# EAGLE design SRAM Breakout (EAGLE 8.0.0)
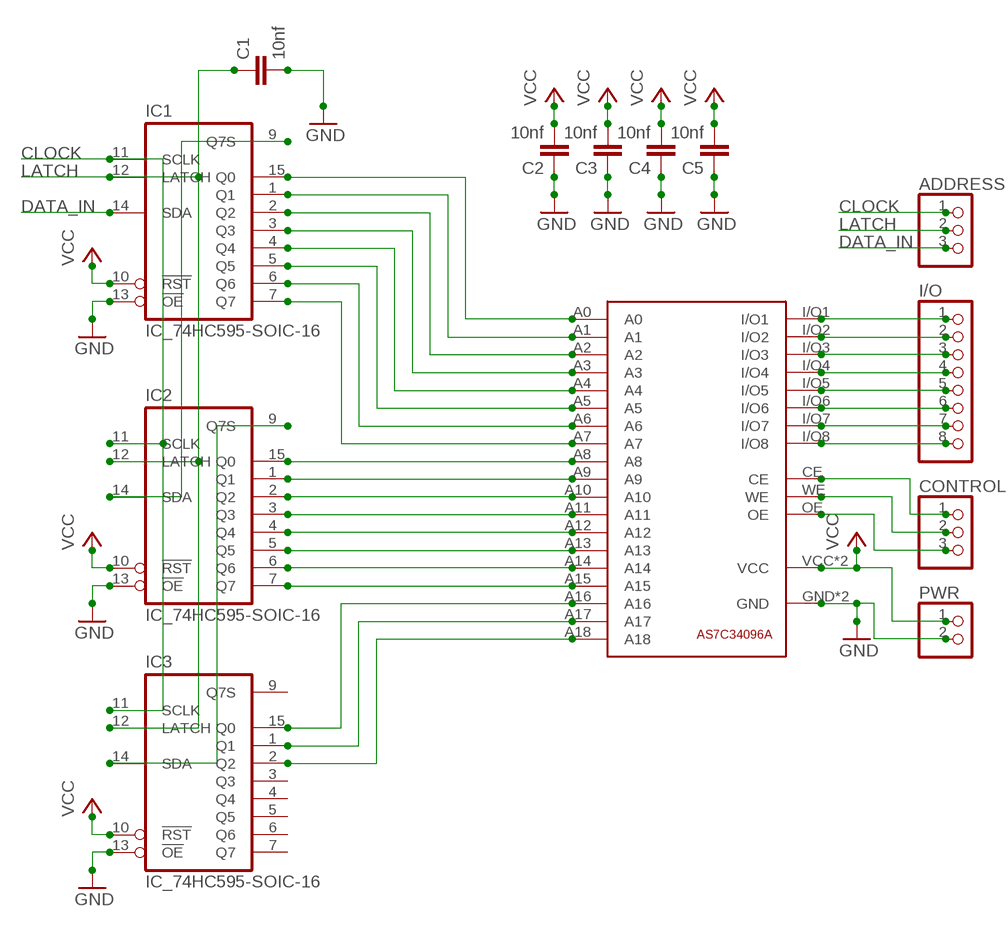
[diagram p0: schematic, sheet 1]

## Parts
ADDRESS  PINHD-1X3/90  [1X03/90]
C1  10nf  C-EUC0603  [C0603]
C2  10nf  C-EUC0603  [C0603]
C3  10nf  C-EUC0603  [C0603]
C4  10nf  C-EUC0603  [C0603]
C5  10nf  C-EUC0603  [C0603]
CONTROL  PINHD-1X3/90  [1X03/90]
I/O  PINHD-1X8/90  [1X08/90]
IC1  IC_74HC595-SOIC-16  [SOIC-16]
IC2  IC_74HC595-SOIC-16  [SOIC-16]
IC3  IC_74HC595-SOIC-16  [SOIC-16]
PWR  PINHD-1X2/90  [1X02/90]
U$1  AS7C34096A  [AS7C34096A]

## Nets
CLOCK: ADDRESS.1 IC1.11(SCLK) IC2.11(SCLK) IC3.11(SCLK)
DATA_IN: ADDRESS.3 IC1.14(SDA)
GND: C1.2 C2.1 C3.1 C4.1 C5.1 IC1.13(!OE) IC2.13(!OE) IC3.13(!OE) PWR.2 U$1.GND U$1.GND0(GND)
LATCH: ADDRESS.2 C1.1 IC1.12(LATCH) IC2.12(LATCH) IC3.12(LATCH)
N$1: IC1.9(Q7S) IC2.14(SDA)
N$2: IC2.9(Q7S) IC3.14(SDA)
N$3: I/O.1 U$1.I/O1
N$4: IC1.15(Q0) U$1.A0
N$5: IC1.1(Q1) U$1.A1
N$6: IC1.2(Q2) U$1.A2
N$7: IC1.3(Q3) U$1.A3
N$8: IC1.4(Q4) U$1.A4
N$9: IC1.5(Q5) U$1.A5
N$10: IC1.6(Q6) U$1.A6
N$11: IC1.7(Q7) U$1.A7
N$12: IC2.15(Q0) U$1.A8
N$13: IC2.1(Q1) U$1.A9
N$14: IC2.2(Q2) U$1.A10
N$15: IC2.3(Q3) U$1.A11
N$16: IC2.4(Q4) U$1.A12
N$17: IC2.5(Q5) U$1.A13
N$18: IC2.6(Q6) U$1.A14
N$19: IC2.7(Q7) U$1.A15
N$20: IC3.15(Q0) U$1.A16
N$21: IC3.1(Q1) U$1.A17
N$22: IC3.2(Q2) U$1.A18
N$23: I/O.2 U$1.I/O2
N$24: I/O.3 U$1.I/O3
N$25: I/O.4 U$1.I/O4
N$26: I/O.5 U$1.I/O5
N$27: I/O.6 U$1.I/O6
N$28: I/O.7 U$1.I/O7
N$29: I/O.8 U$1.I/O8
N$30: CONTROL.1 U$1.CE
N$31: CONTROL.2 U$1.WE
N$32: CONTROL.3 U$1.OE
VCC: C2.2 C3.2 C4.2 C5.2 IC1.10(!RST) IC2.10(!RST) IC3.10(!RST) PWR.1 U$1.VCC U$1.VCC0(VCC)
Unconnected: IC1.8(GND) IC1.16(V+) IC2.8(GND) IC2.16(V+) IC3.3(Q3) IC3.4(Q4) IC3.5(Q5) IC3.6(Q6) IC3.7(Q7) IC3.8(GND) IC3.9(Q7S) IC3.16(V+)

## Library data of the parts
ADDRESS CONTROL = pinhead:PINHD-1X3: PIN HEADER
C1-C5 = rcl:C-EU: CAPACITOR, European symbol
I/O = pinhead:PINHD-1X8: PIN HEADER
IC1-IC3 = dp_devices.v6:IC_74HC595: 8-bit serial-in parallel out shift register, output latch 3-state
PWR = pinhead:PINHD-1X2: PIN HEADER
U$1 = AS7C34096A:AS7C34096A

## Board
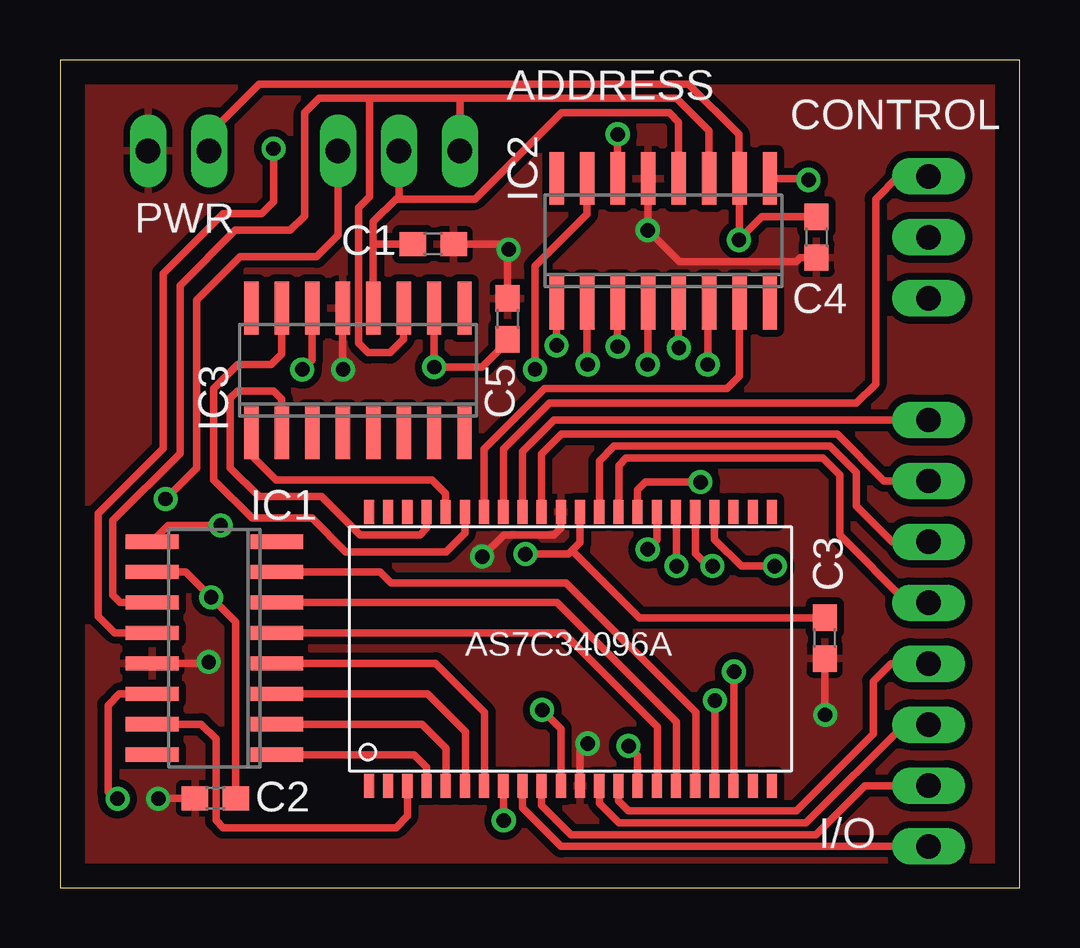
[diagram p1: board, top side]
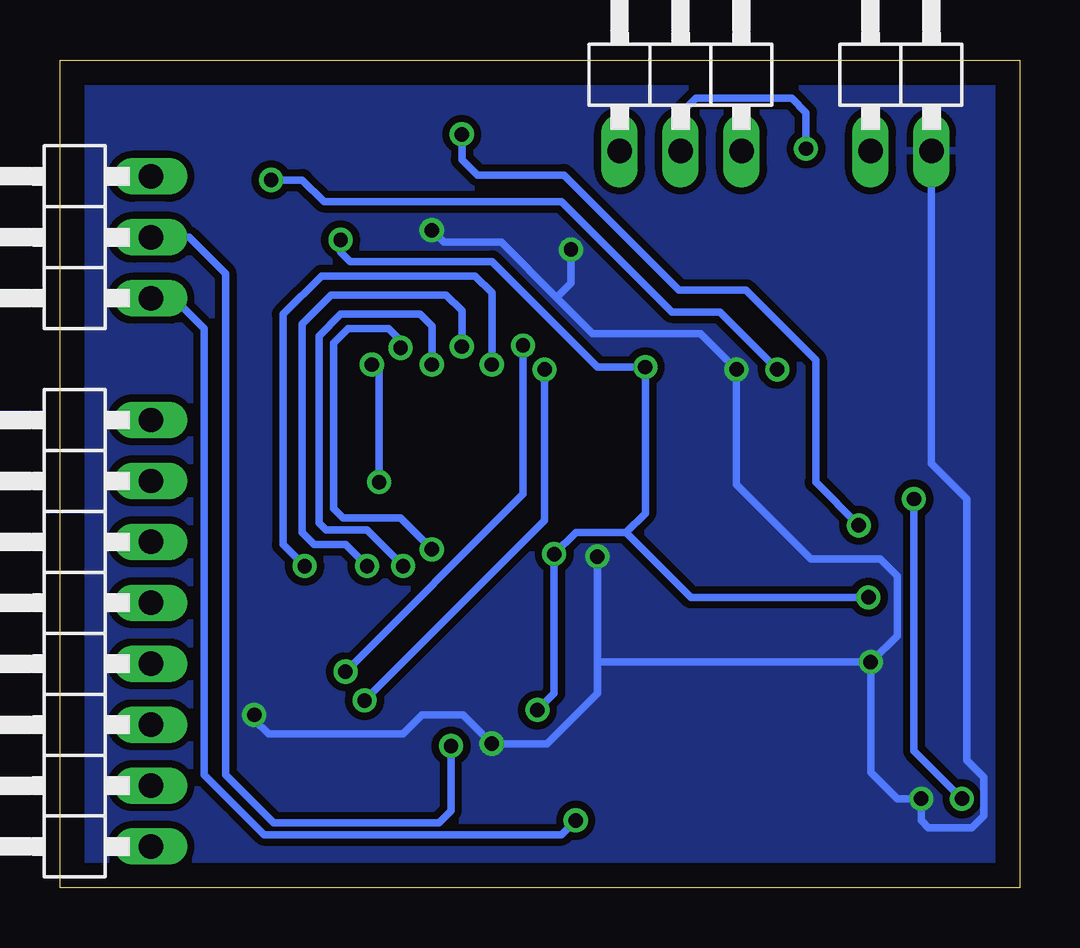
[diagram p2: board, bottom side, seen from below]

Size 40 x 34.5 mm. Coordinates in mm from the lower left corner, seen from the top.
Outline: 0,0 40,0 40,34.5 0,34.5 0,0
Copper layers (1*16): Top 0.035mm / dielectric 1.5mm / Bottom 0.035mm
Design rules "default": minimum track width 10mil, minimum drill 24mil, track to track 8mil, track to pad 8mil, pad to pad 8mil, via to via 8mil, smd to smd 8mil, copper to edge 40mil, drill to drill 8mil, minimum pad ring 10mil, minimum via ring 8mil, stop-mask expansion 4mil, vias tented up to drill 0mil, thermal gap 10mil

### Footprints (pad centres in the part's own frame; a part is rotated, then mirrored left to right if it is on the bottom)
1X03/90 = drill 1.016 long: 1 -2.54,-3.81; 2 0,-3.81; 3 2.54,-3.81
C0603 = smd 1.1 x 1: 1 -0.85,0; 2 0.85,0
1X08/90 = drill 1.016 long: 1 -8.89,-3.81; 2 -6.35,-3.81; 3 -3.81,-3.81; 4 -1.27,-3.81; 5 1.27,-3.81; 6 3.81,-3.81; 7 6.35,-3.81; 8 8.89,-3.81
SOIC-16 = smd 0.6 x 2.2: 1 -4.445,-2.6; 2 -3.175,-2.6; 3 -1.905,-2.6; 4 -0.635,-2.6; 5 0.635,-2.6; 6 1.905,-2.6; 7 3.175,-2.6; 8 4.445,-2.6; 9 4.445,2.6; 10 3.175,2.6; 11 1.905,2.6; 12 0.635,2.6; 13 -0.635,2.6; 14 -1.905,2.6; 15 -3.175,2.6; 16 -4.445,2.6
1X02/90 = drill 1.016 long: 1 -1.27,-3.81; 2 1.27,-3.81
AS7C34096A = smd 0.42 x 1: A0 2.4,0; A1 3.2,0; A2 4,0; A3 4.8,0; A4 5.6,0; A5 12.8,0; A6 13.6,0; A7 14.4,0; A8 15.2,0; A9 16,0; A10 15.2,11.4; A11 14.4,11.4; A12 13.6,11.4; A13 12.8,11.4; A14 12,11.4; A15 5.6,11.4; A16 4.8,11.4; A17 4,11.4; A18 3.2,11.4; CE 6.4,0; GND 9.6,0; GND0 8.8,11.4; I/O1 7.2,0; I/O2 8,0; I/O3 10.4,0; I/O4 11.2,0; I/O5 11.2,11.4; I/O6 10.4,11.4; I/O7 8,11.4; I/O8 7.2,11.4; NC 0.8,0; NC0 1.6,0; NC1 16.8,0; NC2 17.6,0; NC3 0.8,11.4; NC4 1.6,11.4; NC5 2.4,11.4; NC6 16,11.4; NC7 16.8,11.4; NC8 17.6,11.4; OE 6.4,11.4; VCC 8.8,0; VCC0 9.6,11.4; WE 12,0

### Placement (x,y rotation side)
ADDRESS  14.13,34.52 0 bottom
C1  15.56,26.82 0 top
C2  6.48,3.72 0 top
C3  31.88,10.4 90 top
C4  31.54,27.11 90 top
C5  18.66,23.71 270 top
CONTROL  40.02,27.11 90 bottom
I/O  40.02,10.6 90 bottom
IC1  6.44,9.98 90 top
IC2  25.15,26.96 0 top
IC3  12.42,21.56 0 top
PWR  4.94,34.52 0 bottom
U$1  12.08,4.25 0 top

### Tracks (layer width: path | path; a pad name or v marks a point on that pad's centre or on a via)
CLOCK
  Top 0.305: 12.9,32.9 12.9,28.8 12.45,28.35 12.45,22.7 12.85,22.3 13.75,22.3 14.32,22.88 IC3.11 | 16.6,32.9 25.7,32.9 27.05,31.55 IC2.11 | 16.6,32.9 12.9,32.9 | ADDRESS.1 16.67,32.83 16.6,32.9 | IC1.11 2.52,11.88 2.2,12.2 2.2,15.3 5,18.1 5,25.1 7.3,27.4 9.6,27.4 10.2,28 10.2,32.3 10.8,32.9 12.9,32.9
DATA_IN  (via drill 0.6)
  Top 0.305: ADDRESS.3 11.59,27.19 10.7,26.3 7.5,26.3 5.7,24.5 5.7,17.5 v4.4,16.2 | v2.4,3.7 2.3,3.7 2,4 2,7.6 2.48,8.07 IC1.14
  Bottom 0.305: v4.4,16.2 4.4,5.7 v2.4,3.7
GND  (via drill 0.6)
  Top 0.305: U$1.GND0 20.88,14.98 20.6,14.7 18.5,14.7 v17.6,13.8 | U$1.GND 21.68,5.68 v22,6 | IC1.13 6.14,9.35 v6.2,9.4 | IC3.13 11.79,21.61 v11.8,21.6 | 24.52,27.41 IC2.13 | 24.52,27.41 v24.5,27.4 | C3.1 31.88,7.22 v31.9,7.2 | C2.1 4.12,3.72 v4.1,3.7 | C4.1 30.86,26.26 30.7,26.1 25.83,26.1 24.52,27.41 | 18.66,26.56 C5.1 | 18.66,26.56 v18.7,26.6 | C1.2 18.4,26.82 18.66,26.56
  Bottom 0.305: 17.6,9.3 v17.6,13.8 | 17.6,9.3 17.6,8.1 19.7,6 v22,6 23.2,7.2 24.9,7.2 25.7,6.4 31.3,6.4 31.9,7 v31.9,7.2 | v6.2,9.4 17.5,9.4 17.6,9.3 | v6.2,9.4 5.1,10.5 5.1,13 5.8,13.7 8.7,13.7 11.8,16.8 v11.8,21.6 13.3,23.1 17.8,23.1 19.3,24.6 | v24.5,27.4 24,26.9 21.6,26.9 19.3,24.6 | v6.2,9.4 6.2,4.8 5.1,3.7 v4.1,3.7 4.1,2.8 3.8,2.5 2,2.5 1.5,3 1.5,4.6 2.2,5.3 2.2,16.2 3.67,17.67 PWR.2 | v18.7,26.6 18.7,25.2 19.3,24.6
  pour Bottom (isolate 0.305): 0,34.5 40,34.5 40,0 0.42,0 arc-90 0,0.32
  pour Top (isolate 0.305): 0,34.5 40,34.5 40,0 0,0
LATCH  (via drill 0.6)
  Top 0.305: IC2.12 25.79,31.91 25.4,32.3 20.9,32.3 17.3,28.7 14.2,28.7 | 14.2,28.7 14,28.7 13.05,27.75 13.05,26.9 | 13.05,26.9 IC3.12 | ADDRESS.2 14.13,28.77 14.2,28.7 | C1.1 13.13,26.82 13.05,26.9 | IC1.12 2.29,10.62 1.6,11.3 1.6,15.6 4.3,18.3 4.3,25.6 6.8,28.1 8.4,28.1 8.9,28.6 v8.9,30.8
  Bottom 0.305: v8.9,30.8 8.9,32.3 9.5,32.9 13.5,32.9 14.13,32.27 ADDRESS.2
N$1  (via drill 0.6)
  Top 0.305: IC2.14 v23.25,31.39 v23.25,31.4 | v6.7,15.1 4.51,15.1 IC1.9
  Bottom 0.305: v23.25,31.4 23.25,30.35 22.6,29.7 19,29.7 14.2,24.9 11.4,24.9 8.5,22 8.5,16.9 v6.7,15.1
N$2  (via drill 0.6)
  Top 0.305: IC2.9 31.09,29.56 31.15,29.5 v31.2,29.5 | v10.1,21.6 10.5,22 10.5,24.14 IC3.14
  Bottom 0.305: v31.2,29.5 29.9,29.5 29,28.6 19.1,28.6 14.5,24 12.5,24 v10.1,21.6
N$3
  Top 0.305: U$1.I/O1 19.28,3.32 20.89,1.71 I/O.1
N$4
  Top 0.305: IC1.15 5.89,6.8 6.5,6.2 6.5,2.8 6.8,2.5 14,2.5 14.48,2.98 U$1.A0
N$5
  Top 0.305: IC1.1 14.77,5.54 15.28,5.02 U$1.A1
N$6
  Top 0.305: IC1.2 15.1,6.8 16.1,5.8 16.1,4.27 U$1.A2
N$7
  Top 0.305: IC1.3 15.32,8.07 16.9,6.5 16.9,4.27 U$1.A3
N$8
  Top 0.305: IC1.4 15.65,9.35 17.7,7.3 17.7,4.27 U$1.A4
N$9
  Top 0.305: IC1.5 20.98,10.62 24.9,6.7 24.9,4.27 U$1.A5
N$10
  Top 0.305: IC1.6 20.71,11.88 25.7,6.9 25.7,4.27 U$1.A6
N$11
  Top 0.305: U$1.A7 26.5,4.27 26.5,7.3 21.1,12.7 13.8,12.7 13.35,13.15 IC1.7
N$12  (via drill 0.6)
  Top 0.305: IC2.15 21.98,28.07 19.8,25.9 v19.8,21.6 | v27.3,7.8 27.3,4.27 U$1.A8
  Bottom 0.305: v19.8,21.6 19.8,15.3 v27.3,7.8
N$13  (via drill 0.6)
  Top 0.305: IC2.1 20.7,22.7 v20.7,22.6 | v28.1,9 28.1,4.27 U$1.A9
  Bottom 0.305: v20.7,22.6 20.7,16.4 v28.1,9
N$14  (via drill 0.6)
  Top 0.305: IC2.2 21.98,21.82 v22,21.8 | v29.8,13.4 28.4,13.4 27.28,14.52 U$1.A10
  Bottom 0.305: v22,21.8 22,24.8 22.7,25.5 29.1,25.5 30.7,23.9 30.7,14.3 v29.8,13.4
N$15  (via drill 0.6)
  Top 0.305: IC2.3 v23.25,22.55 | v27.2,13.4 27,13.4 26.48,13.92 U$1.A11
  Bottom 0.305: v23.25,22.55 23.25,24.05 23.9,24.7 28.7,24.7 29.9,23.5 29.9,14.8 29.4,14.3 28.1,14.3 v27.2,13.4
N$16  (via drill 0.6)
  Top 0.305: IC2.4 24.52,21.82 v24.5,21.8 | v25.7,13.4 25.7,15.63 U$1.A12
  Bottom 0.305: v24.5,21.8 24.5,23.4 25,23.9 28.3,23.9 29.2,23 29.2,15.2 28.9,14.9 27.2,14.9 v25.7,13.4
N$17  (via drill 0.6)
  Top 0.305: IC2.5 25.79,22.52 v25.8,22.5 | 24.8,14.4 v24.5,14.1 24.88,14.48 U$1.A13
  Bottom 0.305: v25.8,22.5 25.8,22.8 26.3,23.3 28,23.3 28.6,22.7 28.6,15.8 28.2,15.4 25.8,15.4 v24.5,14.1
N$18  (via drill 0.6)
  Top 0.305: U$1.A14 24.08,16.58 24.4,16.9 v26.7,16.9 | v27,21.8 27,24.3 IC2.6
  Bottom 0.305: v26.7,16.9 26.7,21.5 v27,21.8
N$19
  Top 0.305: IC2.7 28.32,21.32 27.8,20.8 20.2,20.8 17.68,18.28 U$1.A15
N$20
  Top 0.305: U$1.A16 16.88,14.78 16.1,14 11.9,14 10.5,15.4 8,15.4 6.4,17 6.4,20.8 7.4,21.8 8.8,21.8 9.24,22.25 IC3.15
N$21
  Top 0.305: U$1.A17 16.08,16.42 15.5,17 9,17 7.97,18.02 IC3.1
N$22
  Top 0.305: U$1.A18 15.28,14.98 15,14.7 12.5,14.7 10.9,16.3 8.3,16.3 7.1,17.5 7.1,20.4 7.4,20.7 8.9,20.7 9.24,20.36 IC3.2
N$23
  Top 0.305: I/O.2 33.55,4.25 31.5,2.2 21.3,2.2 20.08,3.42 U$1.I/O2
N$24
  Top 0.305: I/O.3 35.19,6.79 31.1,2.7 23.3,2.7 22.48,3.52 U$1.I/O3
N$25
  Top 0.305: I/O.4 34.63,9.33 33.9,8.6 33.9,6.4 30.7,3.2 23.7,3.2 23.28,3.62 U$1.I/O4
N$26
  Top 0.305: I/O.5 35.33,11.87 32.5,14.7 32.5,17.2 31.8,17.9 23.6,17.9 23.3,17.6 23.3,15.67 U$1.I/O5
N$27
  Top 0.305: I/O.6 34.69,14.41 33.2,15.9 33.2,17.3 32.1,18.4 23.1,18.4 22.48,17.78 U$1.I/O6
N$28
  Top 0.305: I/O.7 34.35,16.95 32.4,18.9 20.9,18.9 20.08,18.08 U$1.I/O7
N$29
  Top 0.305: I/O.8 20.59,19.49 19.28,18.18 U$1.I/O8
N$30  (via drill 0.6)
  Top 0.305: U$1.CE 18.48,2.82 v18.5,2.8
  Bottom 0.305: CONTROL.1 35.27,24.57 34,23.3 34,4.7 31.5,2.2 19.1,2.2 v18.5,2.8
N$31  (via drill 0.6)
  Top 0.305: 24.1,4.27 U$1.WE 24.08,5.52 v23.7,5.9
  Bottom 0.305: CONTROL.2 34.61,27.11 33.1,25.6 33.1,4.7 31.1,2.7 24.2,2.7 23.7,3.2 v23.7,5.9
N$32
  Top 0.305: U$1.OE 18.48,18.28 20.4,20.2 33.2,20.2 34,21 34,28.7 34.95,29.65 CONTROL.3
VCC  (via drill 0.6)
  Top 0.305: U$1.VCC0 21.68,14.38 21.35,14.05 | 21.35,14.05 21.2,13.9 v19.4,13.9 | U$1.VCC 20.88,6.62 v20.1,7.4 | IC1.10 5.25,13.15 v6.3,12.1 7.33,11.07 C2.2 | IC3.10 v15.6,21.7 17.6,21.7 18.66,22.76 C5.2 | 28.32,27.02 IC2.10 28.3,29.59 28.3,31.4 26.2,33.5 8.3,33.5 6.21,31.41 PWR.1 | 28.32,27.02 v28.3,27 | C3.2 24.15,11.25 21.35,14.05 | C4.2 29.26,27.96 28.32,27.02
  Bottom 0.305: v20.1,7.4 19.4,8.1 v19.4,13.9 18.5,14.8 16.4,14.8 | v6.3,12.1 13.7,12.1 16.4,14.8 | 16.4,14.8 15.6,15.6 v15.6,21.7 17.6,21.7 22,26.1 27.9,26.1 28.3,26.5 v28.3,27